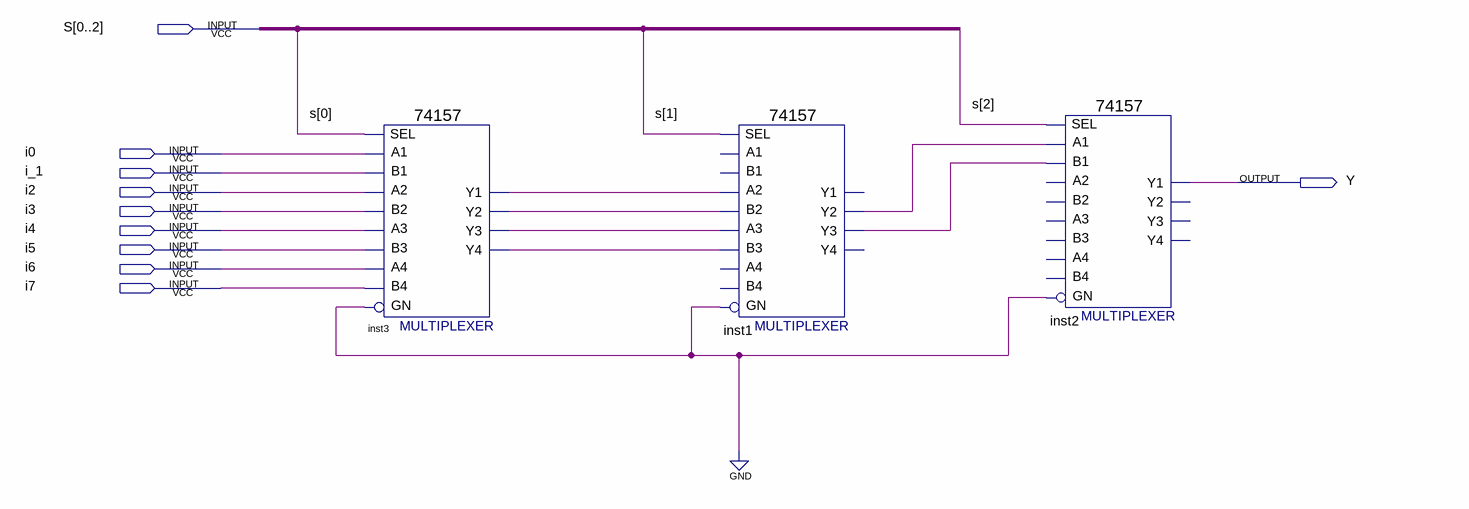
[diagram p0: schematic sheet]
// Quartus schematic exercicio_2.bdf as structural Verilog: 3 symbols, 10 pins
module exercicio_2 (
  input  [0:2] S,
  input  i0,
  input  i_1,
  input  i2,
  input  i3,
  input  i4,
  input  i5,
  input  i6,
  input  i7,
  output Y
);

  wire inst1_y2, inst1_y3, inst3_y1, inst3_y2, inst3_y3, inst3_y4;

  \74157  inst3 (
    .A1(i0), .B1(i_1), .SEL(S[0]), .B2(i3), .A3(i4), .B3(i5), .A2(i2), .B4(i7), .GN(1'b0), .A4(i6),
    .Y2(inst3_y2), .Y1(inst3_y1), .Y4(inst3_y4), .Y3(inst3_y3));
  \74157  inst1 (
    .SEL(S[1]), .B2(inst3_y2), .A3(inst3_y3), .B3(inst3_y4), .A2(inst3_y1), .GN(1'b0), .Y2(inst1_y2),
    .Y3(inst1_y3));  // open: A1, B1, B4, A4, Y1, Y4
  \74157  inst2 (
    .A1(inst1_y2), .B1(inst1_y3), .SEL(S[2]), .GN(1'b0), .Y1(Y));  // open: B2, A3, B3, A2, B4, A4, Y2, Y4, Y3
endmodule
